# Altium schematic sheet mini蓝牙遥控器.SchDoc
size A4
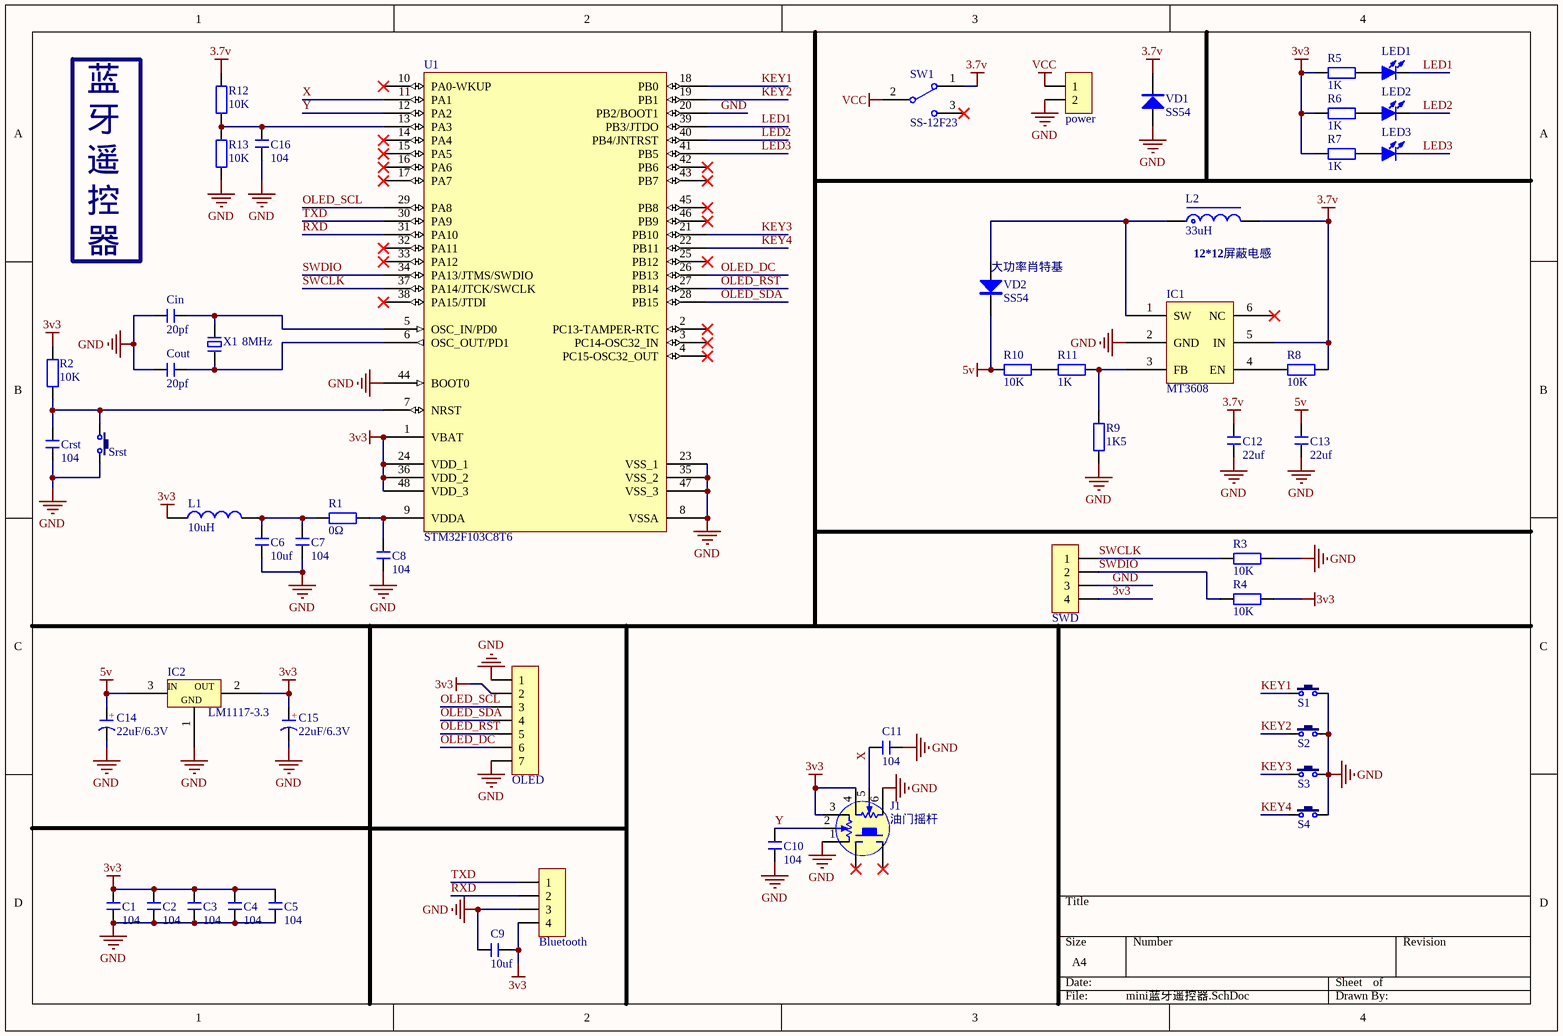
[diagram p0: mini蓝牙遥控器.SchDoc]

## Parts
Bluetooth  HDR-1X4  [HDR-1X4]  (value not drawn)
C1  104  [C 0603]
C2  104  [C 0603]
C3  104  [C 0603]
C4  104  [C 0603]
C5  104  [C 0603]
C6  10uf  [C 0603]
C7  104  [C 0603]
C8  104  [C 0603]
C9  10uf  [C 0603]
C10  104  [C 0603]
C11  104  [C 0603]
C12  22uf  [C 1206]
C13  22uf  [C 1206]
C14  22uF/6.3V  [CD A(3216)]
C15  22uF/6.3V  [CD A(3216)]
C16  104  [C 0603]
Cin  20pf  [C 0603]
Cout  20pf  [C 0603]
Crst  104  [C 0603]
IC1  MT3608  [SOT23-6L]
IC2  LM1117-3.3  [SOT223_L]
J1  油门摇杆  [摇杆2]
L1  10uH  [L 0603]
L2  33uH  [CD54]
LED1  红色  [LED 0603R]  (value not drawn)
LED2  红色  [LED 0603B]  (value not drawn)
LED3  红色  [LED 0603G]  (value not drawn)
OLED  HDR-1X7  [HDR-1X7]  (value not drawn)
power  HDR-1X2  [HDR-1X2]  (value not drawn)
R1  0Ω  [R 0603]
R2  10K  [R 0603]
R3  10K  [R 0603]
R4  10K  [R 0603]
R5  1K  [R 0603]
R6  1K  [R 0603]
R7  1K  [R 0603]
R8  10K  [R 0603]
R9  1K5  [R 0603]
R10  10K  [R 0603]
R11  1K  [R 0603]
R12  10K  [R 0603]
R13  10K  [R 0603]
S1  3x6x5  [TSW SMD-3*6*2.5]  (value not drawn)
S2  3x6x5  [TSW SMD-3*6*2.5]  (value not drawn)
S3  3x6x5  [TSW SMD-3*6*2.5]  (value not drawn)
S4  3x6x5  [TSW SMD-3*6*2.5]  (value not drawn)
Srst  3x6x5  [TSW SMD-3*6*2.5]  (value not drawn)
SW1  SS-12F23  [MSK-12C01-07]
SWD  HDR-1X4  [HDR-1X4]  (value not drawn)
U1  STM32F103C8T6  [LQFP48 7X7_M]
VD1  SS54  [SMA]
VD2  SS54  [SMA]
X1  8MHz  [LC-SMD-5032_2P]

## Nets
3.7v: C12.1 IC1.5(IN) L2.2 R8.2 R12.2 SW1.1 VD1.2(K)
3v3: Bluetooth.4 C1.2 C2.2 C3.2 C4.2 C5.2 C9.2 C15.1(A) IC2.2(OUT) J1.3 J1.4 L1.2 OLED.2 R2.1 R4.1 R5.2 R6.2 R7.2 SWD.4 U1.1(VBAT) U1.24(VDD_1) U1.36(VDD_2) U1.48(VDD_3)
5v: C13.1 C14.1(A) IC2.3(IN) R10.2 VD2.2(K)
GND: Bluetooth.3 C1.1 C2.1 C3.1 C4.1 C5.1 C6.1 C7.1 C8.1 C9.1 C10.2 C11.2 C12.2 C13.2 C14.2(K) C15.2(K) C16.2 Cin.1 Cout.1 Crst.2 IC1.2(GND) IC2.1 J1.1 J1.6 OLED.1 OLED.7 power.2 R3.1 R9.1 R13.1 S1.2 S2.2 S3.2 S4.2 Srst.1 SWD.3 U1.8(VSSA) U1.20(PB2/BOOT1) U1.23(VSS_1) U1.35(VSS_2) U1.44(BOOT0) U1.47(VSS_3) VD1.1(A)
VCC: power.1 SW1.2
KEY1: S1.1 U1.18(PB0)
KEY2: S2.1 U1.19(PB1)
KEY3: S3.1 U1.21(PB10)
KEY4: S4.1 U1.22(PB11)
LED1: LED1.2(K) U1.39(PB3/JTDO)
LED2: LED2.2(K) U1.40(PB4/JNTRST)
LED3: LED3.2(K) U1.41(PB5)
OLED_DC: OLED.6 U1.26(PB13)
OLED_RST: OLED.5 U1.27(PB14)
OLED_SCL: OLED.3 U1.29(PA8)
OLED_SDA: OLED.4 U1.28(PB15)
RXD: Bluetooth.2 U1.31(PA10)
SWCLK: R3.2 SWD.1 U1.37(PA14/JTCK/SWCLK)
SWDIO: R4.2 SWD.2 U1.34(PA13/JTMS/SWDIO)
TXD: Bluetooth.1 U1.30(PA9)
X: C11.1 J1.5 U1.11(PA1)
Y: C10.1 J1.2 U1.12(PA2)
NetC6_2: C6.2 C7.2 L1.1 R1.2
NetC8_2: C8.2 R1.1 U1.9(VDDA)
NetC16_1: C16.1 R12.1 R13.2 U1.13(PA3)
NetCin_2: Cin.2 U1.5(OSC_IN/PD0) X1.2
NetCout_2: Cout.2 U1.6(OSC_OUT/PD1) X1.1
NetCrst_1: Crst.1 R2.2 Srst.2 U1.7(NRST)
NetIC1_1: IC1.1(SW) L2.1 VD2.1(A)
NetIC1_3: IC1.3(FB) R9.2 R11.1
NetIC1_4: IC1.4(EN) R8.1
NetLED1_1: LED1.1(A) R5.1
NetLED2_1: LED2.1(A) R6.1
NetLED3_1: LED3.1(A) R7.1
NetR10_1: R10.1 R11.2

Not connected (* = marked no-connect by the designer): IC1 6(NC)*; J1 J1* J2*; SW1 3*; U1 2(PC13-TAMPER-RTC)* 3(PC14-OSC32_IN)* 4(PC15-OSC32_OUT)* 10(PA0-WKUP)* 14(PA4)* 15(PA5)* 16(PA6)* 17(PA7)* 25(PB12)* 32(PA11)* 33(PA12)* 38(PA15/JTDI)* 42(PB6)* 43(PB7)* 45(PB8)* 46(PB9)*

## Notes on the sheet
- 蓝
- 牙
- 遥
- 控
- 器
- (near VD2) 大功率肖特基
- (near L2) 12*12屏蔽电感
- (in symbol AMS1117) GND
- (in symbol C-CD) +

## Library data of the parts
Bluetooth SWD = Header 4: 4P接插件; 版权归属: 源创客; BOM名称: 4P接插件; 学习资源: www.ooocke.com
C1-C13 C16 Cin Cout Crst = C: 无极性贴片电容; 版权归属: 源创客; BOM名称: 无极性贴片电容; 学习资源: www.ooocke.com
C14 C15 = C-CD: 贴片钽电容; 版权归属: 源创客; BOM名称: 贴片钽电容; 学习资源: www.ooocke.com
IC1 = Component_1
IC2 = AMS1117
J1 = 摇杆
L1 = L: 小功率贴片电感; 版权归属: 源创客; BOM名称: 小功率贴片电感; 学习资源: www.ooocke.com
L2 = L-CD: 贴片功率电感; BOM名称: 功率电感; 版权归属: 源创客; 学习资源: www.ooocke.com
LED1-LED3 = LED-SMD: 贴片LED; 版权归属: 源创客; BOM名称: 贴片LED; 学习资源: www.ooocke.com
OLED = Header 7: 7P接插件; 版权归属: 源创客; BOM名称: 7P接插件; 学习资源: www.ooocke.com
power = Header 2: 2P接插件; 版权归属: 源创客; BOM名称: 2P接插件; 学习资源: www.ooocke.com
R1-R13 = R: 贴片电阻; 版权归属: 源创客; BOM名称: 贴片电阻; 学习资源: www.ooocke.com
S1-S4 Srst = TSW 3x6: 3x6轻触开关; 版权归属: 源创客; BOM名称: 3x6轻触开关; 学习资源: www.ooocke.com
SW1 = SSW-1P: 1路波动开关; BOM名称: 波动开关; 版权归属: 源创客; 学习资源: www.ooocke.com
U1 = STM32F103C8T6: Flaah:64/RAM:20/IO:36; BOM名称: 32位STM单片机; 版权归属: 源创客; 学习资源: www.ooocke.com
VD1 VD2 = SS14: 肖特基二极管; 版权归属: 源创客; 属性: 40V/1A; BOM名称: 肖特基二极管; 学习资源: www.ooocke.com
X1 = XTAL-2: 2脚晶振; 版权归属: 源创客; BOM名称: 2脚晶振; 学习资源: www.ooocke.com